# Altium schematic sheet Microcontrolador.SchDoc
size A4; DocumentNumber: 1; SheetNumber: 1; SheetTotal: 11
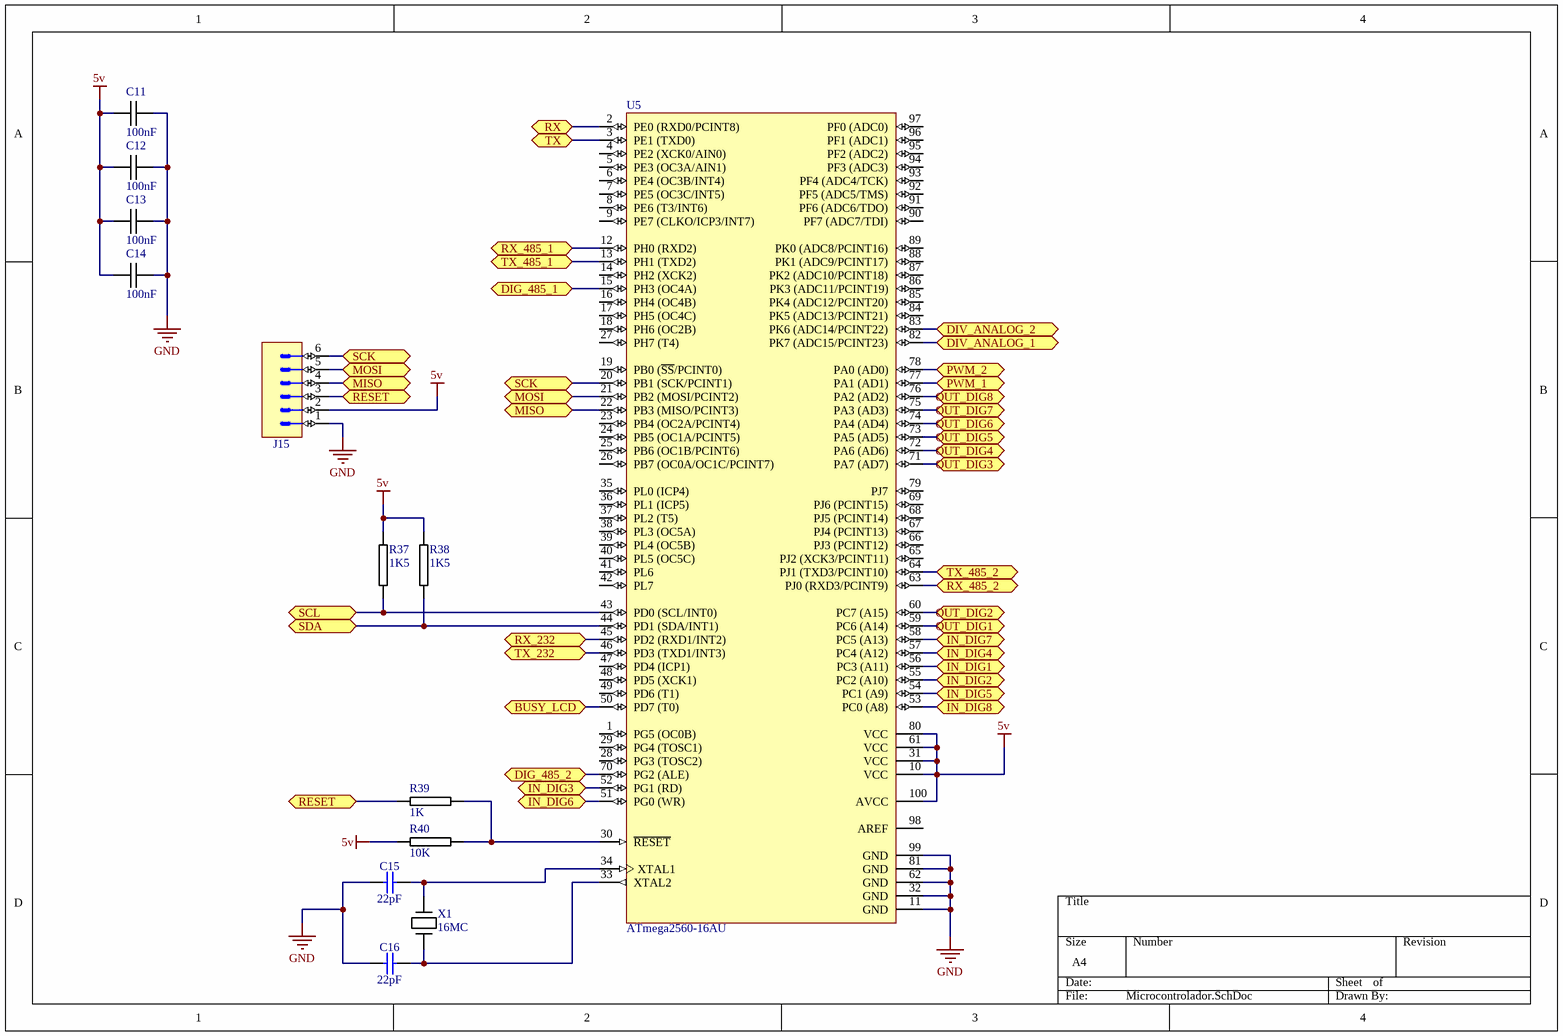
[diagram p0: Microcontrolador.SchDoc]

## Parts
C11  100nF  [0805C-TBD]
C12  100nF  [0805C-TBD]
C13  100nF  [0805C-TBD]
C14  100nF  [0805C-TBD]
C15  22pF  [CAPC2012X135N]
C16  22pF  [CAPC2012X135N]
J15  KK®  [MOLEX_22-27-2061]  (value not drawn)
R37  1K5  [0805R-1K5]
R38  1K5  [0805R-1K5]
R39  1K  [0805R-1K]
R40  10K  [0805R-10K]
U5  ATmega2560-16AU  [100A_N]
X1  16MC  [XTAL-RU49/4]

## Ports
BUSY_LCD, DIG_485_1 (bidir), DIG_485_2 (bidir), DIV_ANALOG_1, DIV_ANALOG_2, IN_DIG1, IN_DIG2, IN_DIG3, IN_DIG4, IN_DIG5, IN_DIG6, IN_DIG7, IN_DIG8, MISO, MOSI, OUT_DIG1, OUT_DIG2, OUT_DIG3, OUT_DIG4, OUT_DIG5, OUT_DIG6, OUT_DIG7, OUT_DIG8, PWM_1, PWM_2, RESET, RX, RX_232, RX_485_1, RX_485_2, SCK, SCL, SDA, TX, TX_232, TX_485_1 (bidir), TX_485_2 (bidir)

## Nets
5v: C11.1 C12.1 C13.1 C14.1 J15.2 R37.1 R38.1 R40.1 U5.10(VCC) U5.31(VCC) U5.61(VCC) U5.80(VCC) U5.100(AVCC)
GND: C11.2 C12.2 C13.2 C14.2 C15.1 C16.1 J15.1 U5.11(GND) U5.32(GND) U5.62(GND) U5.81(GND) U5.99(GND)
BUSY_LCD: U5.50(PD7_(T0)) ; port BUSY_LCD
DIG_485_1: U5.15(PH3_(OC4A)) ; port DIG_485_1
DIG_485_2: U5.70(PG2_(ALE)) ; port DIG_485_2
DIV_ANALOG_1: U5.82(PK7_(ADC15/PCINT23)) ; port DIV_ANALOG_1
DIV_ANALOG_2: U5.83(PK6_(ADC14/PCINT22)) ; port DIV_ANALOG_2
IN_DIG1: U5.56(PC3_(A11)) ; port IN_DIG1
IN_DIG2: U5.55(PC2_(A10)) ; port IN_DIG2
IN_DIG3: U5.52(PG1_(RD)) ; port IN_DIG3
IN_DIG4: U5.57(PC4_(A12)) ; port IN_DIG4
IN_DIG5: U5.54(PC1_(A9)) ; port IN_DIG5
IN_DIG6: U5.51(PG0_(WR)) ; port IN_DIG6
IN_DIG7: U5.58(PC5_(A13)) ; port IN_DIG7
IN_DIG8: U5.53(PC0_(A8)) ; port IN_DIG8
MISO: J15.4 U5.22(PB3_(MISO/PCINT3)) ; port MISO
MOSI: J15.5 U5.21(PB2_(MOSI/PCINT2)) ; port MOSI
OUT_DIG1: U5.59(PC6_(A14)) ; port OUT_DIG1
OUT_DIG2: U5.60(PC7_(A15)) ; port OUT_DIG2
OUT_DIG3: U5.71(PA7_(AD7)) ; port OUT_DIG3
OUT_DIG4: U5.72(PA6_(AD6)) ; port OUT_DIG4
OUT_DIG5: U5.73(PA5_(AD5)) ; port OUT_DIG5
OUT_DIG6: U5.74(PA4_(AD4)) ; port OUT_DIG6
OUT_DIG7: U5.75(PA3_(AD3)) ; port OUT_DIG7
OUT_DIG8: U5.76(PA2_(AD2)) ; port OUT_DIG8
PWM_1: U5.77(PA1_(AD1)) ; port PWM_1
PWM_2: U5.78(PA0_(AD0)) ; port PWM_2
RESET: J15.3 R39.1 ; port RESET
RX: U5.2(PE0_(RXD0/PCINT8)) ; port RX
RX_232: U5.45(PD2_(RXD1/INT2)) ; port RX_232
RX_485_1: U5.12(PH0_(RXD2)) ; port RX_485_1
RX_485_2: U5.63(PJ0_(RXD3/PCINT9)) ; port RX_485_2
SCK: J15.6 U5.20(PB1_(SCK/PCINT1)) ; port SCK
SCL: R37.2 U5.43(PD0_(SCL/INT0)) ; port SCL
SDA: R38.2 U5.44(PD1_(SDA/INT1)) ; port SDA
TX: U5.3(PE1_(TXD0)) ; port TX
TX_232: U5.46(PD3_(TXD1/INT3)) ; port TX_232
TX_485_1: U5.13(PH1_(TXD2)) ; port TX_485_1
TX_485_2: U5.64(PJ1_(TXD3/PCINT10)) ; port TX_485_2
NetC15_2: C15.2 U5.34(XTAL1) X1.1
NetC16_2: C16.2 U5.33(XTAL2) X1.2
NetR39_2: R39.2 R40.2 U5.30(~{RESET})

Not connected (* = marked no-connect by the designer): U5 1(PG5_(OC0B)) 4(PE2_(XCK0/AIN0)) 5(PE3_(OC3A/AIN1)) 6(PE4_(OC3B/INT4)) 7(PE5_(OC3C/INT5)) 8(PE6_(T3/INT6)) 9(PE7_(CLKO/ICP3/INT7)) 14(PH2_(XCK2)) 16(PH4_(OC4B)) 17(PH5_(OC4C)) 18(PH6_(OC2B)) 19(PB0_(~{SS}/PCINT0)) 23(PB4_(OC2A/PCINT4)) 24(PB5_(OC1A/PCINT5)) 25(PB6_(OC1B/PCINT6)) 26(PB7_(OC0A/OC1C/PCINT7)) 27(PH7_(T4)) 28(PG3_(TOSC2)) 29(PG4_(TOSC1)) 35(PL0_(ICP4)) 36(PL1_(ICP5)) 37(PL2_(T5)) 38(PL3_(OC5A)) 39(PL4_(OC5B)) 40(PL5_(OC5C)) 41(PL6) 42(PL7) 47(PD4_(ICP1)) 48(PD5_(XCK1)) 49(PD6_(T1)) 65(PJ2_(XCK3/PCINT11)) 66(PJ3_(PCINT12)) 67(PJ4_(PCINT13)) 68(PJ5_(PCINT14)) 69(PJ6_(PCINT15)) 79(PJ7) 84(PK5_(ADC13/PCINT21)) 85(PK4_(ADC12/PCINT20)) 86(PK3_(ADC11/PCINT19)) 87(PK2_(ADC10/PCINT18)) 88(PK1_(ADC9/PCINT17)) 89(PK0_(ADC8/PCINT16)) 90(PF7_(ADC7/TDI)) 91(PF6_(ADC6/TDO)) 92(PF5_(ADC5/TMS)) 93(PF4_(ADC4/TCK)) 94(PF3_(ADC3)) 95(PF2_(ADC2)) 96(PF1_(ADC1)) 97(PF0_(ADC0)) 98(AREF)

## Library data of the parts
C11-C14 = 0805C-100nF-25V-X7R-MUR: CAPACITOR 0805 CERAMIC; Supplier 1: Digi-Key; Supplier Part Number 1: 490-1673-1-ND
C15 C16 = CC0805_22PF_50V_5%_NP0: Non-polarised capacitor; Part Description: SMD Multilayer Chip Ceramic Capacitor; Manufacturer: GENERIC; Manufacturer1 Part Number: 223886115229; Voltage: 50V; TC: NP0; Tolerance: ±5%; Table: Capacitors SMD; Part Number: CC0805_22PF_50V_5%_NP0; Component Kind: Standard; Component Type: Standard; Pin Count: 2; Value: 22pF; Status: Preferred; Manufacturer Part Number: CC0805_22PF_50V_5%_NP0; Case: 0805; Mounted: Yes; Socket: No; SMD: Yes; Manufacturer1 Example: PHYCOMP; Manufacturer1 ComponentHeight: 1.35mm; HelpURL: \\cern.ch\dfs\Applications\Altium\Datasheets\CC0805_NP0_PHYCOMP.pdf; Author: CERN DEM JLC; CreateDate: 03/12/2007; LatestRevisionDate: 03/12/2007
J15 = MOLEX_22-27-2061: Connector 6 Male; Part Description: 2.54mm (.100") Pitch KK® Wire-to-Board Header, Vertical, with Friction Lock, 6 Circuits, Tin (Sn) Plating; Manufacturer: MOLEX; Part Number: MOLEX_22-27-2061; Component Kind: Standard; Component Type: Standard; Pin Count: 6; Family: KK®; Mounted: Yes; Socket: No; SMD: No; Status: None; Manufacturer Part Number: 22-27-2061; ComponentHeight: 11.7mm; HelpURL: \\cern.ch\dfs\Applications\Altium\Datasheets\MOLEX_22-27-2061.pdf; Author: CERN DEM JMW; CreateDate: 30/11/2011; LatestRevisionDate: 30/11/2011; Table: MOLEX
R37 R38 = 0805R-1K5: RESISTOR 0805 1/4 WATT THIN FILM; Reel: *
R39 = 0805R-1K: RESISTOR 0805 1/4 WATT THIN FILM; Reel: *
R40 = 0805R-10K: RESISTOR 0805 1/4 WATT THIN FILM; Reel: *
U5 = ATmega2560-16AU: 8-bit AVR Microcontroller, 4.5-5.5V, 16MHz, 256KB Flash, 4KB EEPROM, 8KB SRAM, 86 GPIO pins, 100-pin TQFP, Industrial Grade (-40°C to 85°C), Pb-Free; DatasheetVersion: revN, May-2011; PackageVersion: revD, Oct-2010; PackageReference: 100A; PackageDescription: 100-Pin Thin Profile Plastic Quad Flat Pack (TQFP), 14 x 14 x 1.0 mm Body, 0.5 mm Pitch; Code_JEDEC: MS-026-AED; ComponentLink1Description: Manufacturer URL; ComponentLink1URL: http://www.atmel.com/; ComponentLink2Description: ATmega640/1280/1281/2560/2561 Datasheet; ComponentLink2URL: http://www.atmel.com/dyn/resources/prod_documents/doc2549.pdf; ComponentLink3Description: ATmega640/1280/1281/2560/2561 Summary; ComponentLink3URL: http://www.atmel.com/dyn/resources/prod_documents/2549S.pdf
X1 = 16MC-HC49US: 16MHZ CRSYTAL HC49US; Supplier 1: Mouser; Supplier Part Number 1: 815-ABLS-16.0M-T